# Altium project Arduino UNO R3-V2.PrjPcb
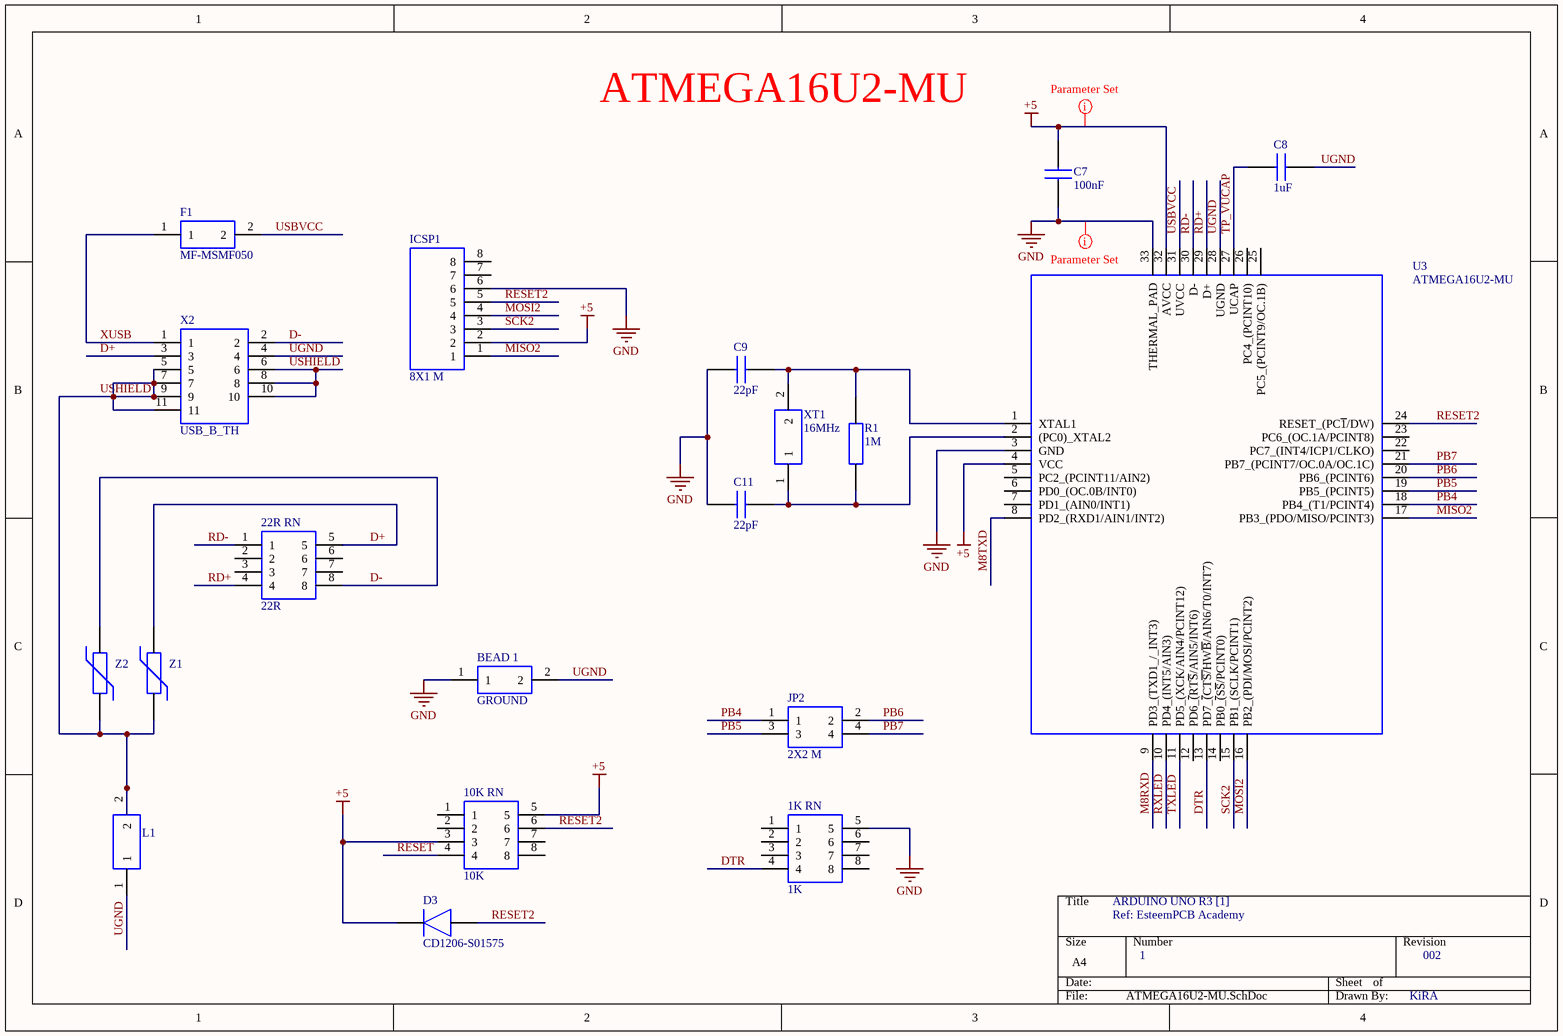
[diagram p0: ATMEGA16U2-MU.SchDoc]
3 sheets, 49 parts. Net scope: global (net labels, ports and power ports of the same name join across sheets).
Board file: Arduino.PcbDoc
Sheets:
  ATMEGA16U2-MU.SchDoc
  ATMega328P-PU.SchDoc
  Connectors & Regulators.SchDoc

## Sheet ATMEGA16U2-MU.SchDoc
size A4; SheetNumber: 1; SheetTotal: 3

### Parts
1K_RN  1K  [CAY10-XXXJ4]
10K_RN  10K  [CAY10-XXXJ4]
22R_RN  22R  [CAY10-XXXJ4]
BEAD_1  GROUND  [BEADC2012X105N]
C7  100nF  [CAPC2012X130N]
C8  1uF  [CAPC2012X145N]
C9  22pF  [CAPC2012X70N]
C11  22pF  [CAPC2012X70N]
D3  CD1206-S01575  [DIOC3016X65N]
F1  MF-MSMF050  [FUSC4632X75N]
ICSP1  8X1 M  [HDRV8W90P0X254_1X8_2032X249X560P]
JP2  2X2 M  [HDRV4W77P254_2X2_467X488X821P]
L1  BLM21BD601SH1D  [BEADC2012X105N]  (value not drawn)
R1  1M  [RESC1608X55N]
U3  ATMEGA16U2-MU  [QFN50P500X500X100-33N-D]
X2  USB_B_TH  [17340351]
XT1  16MHz  [MODEL-445]
Z1  CG0603MLC-05E  [VARC1608X55N]  (value not drawn)
Z2  CG0603MLC-05E  [VARC1608X55N]  (value not drawn)

### Nets
+5: 10K_RN.3 10K_RN.5 C7.2 D3.1(K) ICSP1.2 U3.4(VCC) U3.32(AVCC)
GND: 1K_RN.5 BEAD_1.1 C7.1 C9.1 C11.1 ICSP1.6 U3.3(GND) U3.33(THERMAL_PAD)
D+: 22R_RN.5 X2.3 Z1.2
D-: 22R_RN.8 X2.2 Z2.2
DTR: 1K_RN.4 U3.13(PD7_~{(}CT~{S/}HW~{B}/AIN6/T0/INT7))
M8RXD: U3.9(PD3_(TXD1_/_INT3))
M8TXD: U3.8(PD2_(RXD1/AIN1/INT2))
MISO2: ICSP1.1 U3.17(PB3_(PDO/MISO/PCINT3))
MOSI2: ICSP1.4 U3.16(PB2_(PDI/MOSI/PCINT2))
PB4: JP2.1 U3.18(PB4_(T1/PCINT4))
PB5: JP2.3 U3.19(PB5_(PCINT5))
PB6: JP2.2 U3.20(PB6_(PCINT6))
PB7: JP2.4 U3.21(PB7_(PCINT7/OC.0A/OC.1C))
RD+: 22R_RN.4 U3.29(D+)
RD-: 22R_RN.1 U3.30(D-)
RESET: 10K_RN.4
RESET2: 10K_RN.6 D3.2(A) ICSP1.5 U3.24(RESET_(PC~{1}/DW))
RXLED: U3.10(PD4_(INT5/AIN3))
SCK2: ICSP1.3 U3.15(PB1_(SCLK/PCINT1))
TP_VUCAP: C8.2 U3.27(UCAP)
TXLED: U3.11(PD5_(XCK/AIN4/PCINT12))
UGND: BEAD_1.2 C8.1 L1.1 U3.28(UGND) X2.4
USBVCC: F1.2 U3.31(UVCC)
USHIELD: L1.2 X2.5 X2.6 X2.7 X2.8 X2.9 X2.10 X2.11 Z1.1 Z2.1
XUSB: F1.1 X2.1
NetC9_2: C9.2 R1.2 U3.1(XTAL1) XT1.2
NetC11_2: C11.2 R1.1 U3.2((PC0)_XTAL2) XT1.1

Not connected (* = marked no-connect by the designer): 1K_RN 1 2 3 6 7 8; 10K_RN 1 2 7 8; 22R_RN 2 3 6 7; ICSP1 7 8; U3 5(PC2_(PCINT11/AIN2)) 6(PD0_(OC.0B/INT0)) 7(PD1_(AIN0/INT1)) 12(PD6_~{(}RT~{S}/AIN5/INT6)) 14(PB0_~{(}S~{S}/PCINT0)) 22(PC7_(INT4/ICP1/CLKO)) 23(PC6_(OC.1A/PCINT8)) 25(PC5_(PCINT9/OC.1B)) 26(PC4_(PCINT10))

### Layout directives
rule Width Constraint [Pref Width = 0.3mm    Min Width = 0.3mm    Max Width = 0.3mm]: +5, GND

### Notes on the sheet
- ATMEGA16U2-MU
- ARDUINO UNO R3 [1]
- Ref: EsteemPCB Academy
- 1
- 002
- KiRA

### Library data of the parts
1K_RN 10K_RN 22R_RN = CAY10-220J4LF: CAY10 convex chip resistor array,22R Bourns CAY10 Series 22 5% Isolated SMT Resistor Array, 4 Resistors, 0.125W total 0804 package Convex; Allied_Number: 70276318; Manufacturer_Name: Bourns; Manufacturer_Part_Number: CAY10-220J4LF; RS Part Number: 1674746; RS Price/Stock: http://uk.rs-online.com/web/p/products/1674746; Allied Price/Stock: https://www.alliedelec.com/bourns-cay10-220j4lf/70276318/; Mouser Part Number: 652-CAY10-220J4LF; Mouser Price/Stock: https://www.mouser.com/Search/Refine.aspx?Keyword=652-CAY10-220J4LF; Datasheet Link: http://docs-emea.rs-online.com/webdocs/064e/0900766b8064e463.pdf
BEAD_1 L1 = BLM21BD601SH1D: Chip Ferrite Bead 600R 0805 300mA 1LN; Manufacturer_Name: Murata Electronics; Geometry.Height: 1.05mm; Manufacturer_Part_Number: BLM21BD601SH1D; RS Part Number: 1048541P; RS Price/Stock: http://uk.rs-online.com/web/p/products/1048541P; Mouser Part Number: 81-BLM21BD601SH1D; Mouser Price/Stock: https://www.mouser.com/Search/Refine.aspx?Keyword=81-BLM21BD601SH1D; Datasheet Link: https://componentsearchengine.com/Datasheets/2/BLM21BD601SH1D.pdf
C7 = 0805Y0500104KXT: Syfer Technology 0805 Flexicap 100nF Ceramic Multilayer Capacitor, 50 V, +125C, X7R Dielectric, 10% SMD; Geometry.Height: 1.3mm; Manufacturer_Name: Syfer; Manufacturer_Part_Number: 0805Y0500104KXT; RS Part Number: 7738389P; RS Price/Stock: http://uk.rs-online.com/web/p/products/7738389P; Mouser Part Number: 7738389P; Mouser Price/Stock: http://uk.rs-online.com/web/p/products/7738389P; Datasheet Link: http://docs-emea.rs-online.com/webdocs/119d/0900766b8119d7bc.pdf
C8 = C2012C0G2A103J125AA: Multilayer Ceramic Capacitors MLCC - SMD/SMT 0805 C0G 100volts 0.01uF 5% 1.25mm; Manufacturer_Name: TDK; Geometry.Height: 1.45mm; Manufacturer_Part_Number: C2012C0G2A103J125AA; RS Part Number: *; RS Price/Stock: *; Mouser Part Number: 810-C2012C0G2A103JAA; Mouser Price/Stock: https://www.mouser.com/Search/Refine.aspx?Keyword=810-C2012C0G2A103JAA; Datasheet Link: https://product.tdk.com/info/en/catalog/datasheets/mlcc_commercial_midvoltage_en.pdf
C9 C11 = GRM2165C1H220JZ01D: MURATA - GRM2165C1H220JZ01D - CAP, MLCC, C0G/NP0, 22PF, 50V, 0805; Manufacturer_Name: Murata Electronics; Geometry.Height: 0.7mm; Manufacturer_Part_Number: GRM2165C1H220JZ01D; RS Part Number: 7236243; RS Price/Stock: http://uk.rs-online.com/web/p/products/7236243; Mouser Part Number: 81-GRM2165C1H220JZ; Mouser Price/Stock: https://www.mouser.com/Search/Refine.aspx?Keyword=81-GRM2165C1H220JZ; Datasheet Link: http://www.murata.com/~/media/webrenewal/support/library/catalog/products/capacitor/mlcc/c02e.pdf
D3 = CD1206-S01575: Diode Switching 100V 0.15A 4ns SMD1206 Bourns CD1206-S01575 Switching Diode, 150mA, 100V, 4ns, 2-Pin 1206; Allied_Number: 70154675; Geometry.Height: 0.65mm; Manufacturer_Name: Bourns; Manufacturer_Part_Number: CD1206-S01575; RS Part Number: 1775431; RS Price/Stock: http://uk.rs-online.com/web/p/products/1775431; Allied Price/Stock: http://www.alliedelec.com/bourns-cd1206-s01575/70154675/; Mouser Part Number: 652-CD1206-S01575; Mouser Price/Stock: https://www.mouser.com/Search/Refine.aspx?Keyword=652-CD1206-S01575; Datasheet Link: http://docs-emea.rs-online.com/webdocs/1189/0900766b811897a9.pdf
F1 = 1812L050_30PR: Littelfuse 0.5A Resettable Surface Mount Fuse, 30V dc; Manufacturer_Part_Number: 1812L050/30PR; Geometry.Height: 0.75mm; Manufacturer_Name: LITTELFUSE; RS Part Number: 8951631P; RS Price/Stock: http://uk.rs-online.com/web/p/products/8951631P; Mouser Part Number: 576-1812L050/30PR; Mouser Price/Stock: https://www.mouser.com/Search/Refine.aspx?Keyword=576-1812L050%2F30PR; Datasheet Link: https://www.arrow.com/en/products/1812l05030pr/littelfuse
ICSP1 = 90120-0768: 8 way single row straight header Molex C-GRID III Series, Series Number 90120, 2.54mm Pitch 8 Way 1 Row Straight Pin Header, Through Hole; Allied_Number: 70372836; Geometry.Height: 5.6mm; Manufacturer_Name: Molex; Manufacturer_Part_Number: 90120-0768; RS Part Number: 1671900; RS Price/Stock: http://uk.rs-online.com/web/p/products/1671900; Allied Price/Stock: https://www.alliedelec.com/molex-incorporated-90120-0768/70372836/; Mouser Part Number: 538-90120-0768; Mouser Price/Stock: https://www.mouser.com/Search/Refine.aspx?Keyword=538-90120-0768; Datasheet Link: http://www.molex.com/molex/products/datasheet.jsp?part=active/0901200768_PCB_HEADERS.xml
JP2 = 5-146256-2: AMP - TE CONNECTIVITY - 5-146256-2 - CONNECTOR, HEADER, 4 POSITION, 2ROWS, 2.54MM; Allied_Number: 70085239; Geometry.Height: 8.21mm; Manufacturer_Name: TE Connectivity; Manufacturer_Part_Number: 5-146256-2; RS Part Number: 7972955; RS Price/Stock: http://uk.rs-online.com/web/p/products/7972955; Allied Price/Stock: https://www.alliedelec.com/te-connectivity-5-146256-2/70085239/; Mouser Part Number: 571-5-146256-2; Mouser Price/Stock: https://www.mouser.com/Search/Refine.aspx?Keyword=571-5-146256-2; Datasheet Link: http://www.mouser.com/ds/2/418/NG_CD_146256_H-649289.pdf
R1 = CPF0603B1M0E1: TE CONNECTIVITY - CPF0603B1M0E1 - RES, THIN FILM, 1M, 0.1%, 0.063W, 0603; Geometry.Height: 0.55mm; Manufacturer_Name: TE Connectivity; Manufacturer_Part_Number: CPF0603B1M0E1; RS Part Number: *; RS Price/Stock: *; Mouser Part Number: 279-CPF0603B1M0E1; Mouser Price/Stock: https://www.mouser.com/Search/Refine.aspx?Keyword=279-CPF0603B1M0E1; Datasheet Link: http://www.farnell.com/datasheets/1786775.pdf
U3 = ATMEGA16U2-MU: 8-bit Microcontrollers - MCU AVR USB 8K FLASH AVR USB 16K FLASH; Manufacturer_Name: Microchip; Geometry.Height: 1mm; Manufacturer_Part_Number: ATMEGA16U2-MU; RS Part Number: 1717746; RS Price/Stock: http://uk.rs-online.com/web/p/products/1717746; Mouser Part Number: 556-ATMEGA16U2-MU; Mouser Price/Stock: https://www.mouser.com/Search/Refine.aspx?Keyword=556-ATMEGA16U2-MU; Datasheet Link: http://ww1.microchip.com/downloads/en/DeviceDoc/doc7799.pdf
X2 = 1734035-1: AMP - TE CONNECTIVITY - 1734035-1. - MINI USB, 2.0 TYPE B, RECEPTACLE, SMT; Allied_Number: 70086812; Geometry.Height: 4mm; Manufacturer_Name: TE Connectivity; Manufacturer_Part_Number: 1734035-1; RS Part Number: *; RS Price/Stock: *; Allied Price/Stock: https://www.alliedelec.com/te-connectivity-1734035-1/70086812/; Mouser Part Number: 571-1734035-1; Mouser Price/Stock: https://www.mouser.com/Search/Refine.aspx?Keyword=571-1734035-1; Datasheet Link: http://www.te.com/commerce/DocumentDelivery/DDEController?Action=srchrtrv&DocNm=1734035&DocType=Customer+Drawing&DocLang=English
XT1 = 445I35D16M00000: Crystals 16MHz +/-30ppm 18pF -40C +85C; Manufacturer_Name: CTS; Manufacturer_Part_Number: 445I35D16M00000; RS Part Number: *; RS Price/Stock: *; Mouser Part Number: 774-445I35D16M00000; Mouser Price/Stock: https://www.mouser.com/Search/Refine.aspx?Keyword=774-445I35D16M00000; Datasheet Link: http://www.mouser.com/ds/2/96/008-0360-0-786290.pdf
Z1 Z2 = CG0603MLC-05E: Varistor, ESD Protector, 5VDC,20V,0603 Bourns MLC Series Power Varistor 0.5pF 20V 0603 Case; Allied_Number: 70153503; Geometry.Height: 0.55mm; Manufacturer_Name: Bourns; Manufacturer_Part_Number: CG0603MLC-05E; RS Part Number: 8518256; RS Price/Stock: http://uk.rs-online.com/web/p/products/8518256; Allied Price/Stock: https://www.alliedelec.com/bourns-cg0603mlc-05e/70153503/; Mouser Part Number: 652-CG0603MLC-05E; Mouser Price/Stock: https://www.mouser.com/Search/Refine.aspx?Keyword=652-CG0603MLC-05E; Datasheet Link: http://www.farnell.com/datasheets/1785244.pdf

## Sheet ATMega328P-PU.SchDoc
size A4; SheetNumber: 2; SheetTotal: 3
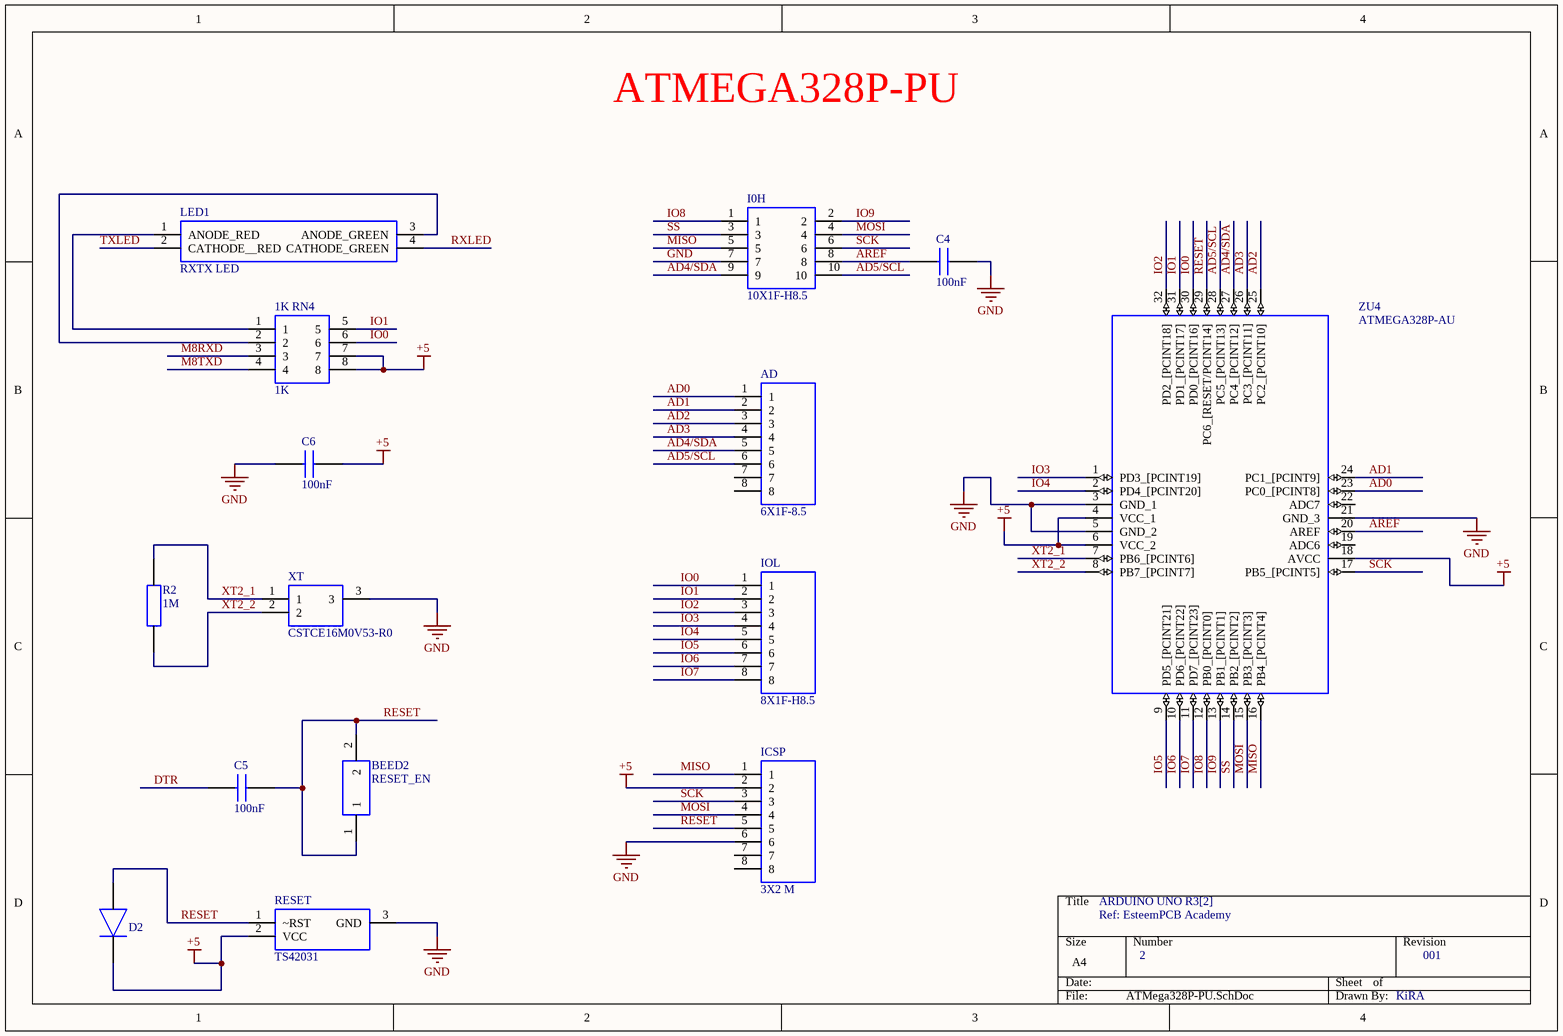
[diagram p1: ATMega328P-PU.SchDoc]

### Parts
1K_RN4  1K  [CAY10-XXXJ4]
AD  6X1F-8.5  [HDRV8W90P0X254_1X8_2032X249X560P]
BEED2  RESET_EN  [BEADC2012X105N]
C4  100nF  [CAPC2012X130N]
C5  100nF  [CAPC2012X130N]
C6  100nF  [CAPC2012X130N]
D2  CD1206-S01575  [DIOC3016X65N]  (value not drawn)
I0H  10X1F-H8.5  [FTMH10503LDV]
ICSP  3X2 M  [HDRV8W90P0X254_1X8_2032X249X560P]
IOL  8X1F-H8.5  [HDRV8W90P0X254_1X8_2032X249X560P]
LED1  RXTX LED  [SML522MD8WT86]
R2  1M  [RESC1608X55N]
RESET  TS42031  [SOT95P240X110-3N]
XT  CSTCE16M0V53-R0  [CSTCE-V]
ZU4  ATMEGA328P-AU  [QFP80P900X900X120-32N]

### Nets
+5: 1K_RN4.7 1K_RN4.8 C6.2 D2.1(K) ICSP.2 RESET.2(VCC) ZU4.4(VCC_1) ZU4.6(VCC_2) ZU4.18(AVCC)
GND: C4.2 C6.1 I0H.7 ICSP.6 RESET.3(GND) XT.3 ZU4.3(GND_1) ZU4.5(GND_2) ZU4.21(GND_3)
AD0: AD.1 ZU4.23(PC0_[PCINT8])
AD1: AD.2 ZU4.24(PC1_[PCINT9])
AD2: AD.3 ZU4.25(PC2_[PCINT10])
AD3: AD.4 ZU4.26(PC3_[PCINT11])
AD4/SDA: AD.5 I0H.9 ZU4.27(PC4_[PCINT12])
AD5/SCL: AD.6 I0H.10 ZU4.28(PC5_[PCINT13])
AREF: C4.1 I0H.8 ZU4.20(AREF)
DTR: C5.1
IO0: 1K_RN4.6 IOL.1 ZU4.30(PD0_[PCINT16])
IO1: 1K_RN4.5 IOL.2 ZU4.31(PD1_[PCINT17])
IO2: IOL.3 ZU4.32(PD2_[PCINT18])
IO3: IOL.4 ZU4.1(PD3_[PCINT19])
IO4: IOL.5 ZU4.2(PD4_[PCINT20])
IO5: IOL.6 ZU4.9(PD5_[PCINT21])
IO6: IOL.7 ZU4.10(PD6_[PCINT22])
IO7: IOL.8 ZU4.11(PD7_[PCINT23])
IO8: I0H.1 ZU4.12(PB0_[PCINT0])
IO9: I0H.2 ZU4.13(PB1_[PCINT1])
M8RXD: 1K_RN4.3
M8TXD: 1K_RN4.4
MISO: I0H.5 ICSP.1 ZU4.16(PB4_[PCINT4])
MOSI: I0H.4 ICSP.4 ZU4.15(PB3_[PCINT3])
RESET: BEED2.1 BEED2.2 C5.2 D2.2(A) ICSP.5 RESET.1(~RST) ZU4.29(PC6_[RESET/PCINT14])
RXLED: LED1.4(CATHODE_GREEN)
SCK: I0H.6 ICSP.3 ZU4.17(PB5_[PCINT5])
SS: I0H.3 ZU4.14(PB2_[PCINT2])
TXLED: LED1.2(CATHODE__RED)
XT2_1: R2.2 XT.1 ZU4.7(PB6_[PCINT6])
XT2_2: R2.1 XT.2 ZU4.8(PB7_[PCINT7])
Net1K_RN4_1: 1K_RN4.1 LED1.1(ANODE_RED)
Net1K_RN4_2: 1K_RN4.2 LED1.3(ANODE_GREEN)

Not connected (* = marked no-connect by the designer): AD 7 8; ICSP 7 8; ZU4 19(ADC6) 22(ADC7)

### Notes on the sheet
- ATMEGA328P-PU
- ARDUINO UNO R3[2]
- Ref: EsteemPCB Academy
- 2
- 001
- KiRA

### Library data of the parts
1K_RN4 = CAY10-220J4LF: as 1K_RN on sheet ATMEGA16U2-MU; Manufacturer_Name: Bourns; Manufacturer_Part_Number: CAY10-220J4LF; RS Part Number: 1674746; RS Price/Stock: http://uk.rs-online.com/web/p/products/1674746; Allied Price/Stock: https://www.alliedelec.com/bourns-cay10-220j4lf/70276318/; Mouser Part Number: 652-CAY10-220J4LF; Mouser Price/Stock: https://www.mouser.com/Search/Refine.aspx?Keyword=652-CAY10-220J4LF; Datasheet Link: http://docs-emea.rs-online.com/webdocs/064e/0900766b8064e463.pdf
AD ICSP IOL = 90120-0768: as ICSP1 on sheet ATMEGA16U2-MU; Manufacturer_Name: Molex; Manufacturer_Part_Number: 90120-0768; RS Part Number: 1671900; RS Price/Stock: http://uk.rs-online.com/web/p/products/1671900; Allied Price/Stock: https://www.alliedelec.com/molex-incorporated-90120-0768/70372836/; Mouser Part Number: 538-90120-0768; Mouser Price/Stock: https://www.mouser.com/Search/Refine.aspx?Keyword=538-90120-0768; Datasheet Link: http://www.molex.com/molex/products/datasheet.jsp?part=active/0901200768_PCB_HEADERS.xml
BEED2 = BLM21BD601SH1D: as BEAD_1 on sheet ATMEGA16U2-MU; Manufacturer_Part_Number: BLM21BD601SH1D; RS Part Number: 1048541P; RS Price/Stock: http://uk.rs-online.com/web/p/products/1048541P; Mouser Part Number: 81-BLM21BD601SH1D; Mouser Price/Stock: https://www.mouser.com/Search/Refine.aspx?Keyword=81-BLM21BD601SH1D; Datasheet Link: https://componentsearchengine.com/Datasheets/2/BLM21BD601SH1D.pdf
C4-C6 = 0805Y0500104KXT: as C7 on sheet ATMEGA16U2-MU; Manufacturer_Name: Syfer; Manufacturer_Part_Number: 0805Y0500104KXT; RS Part Number: 7738389P; RS Price/Stock: http://uk.rs-online.com/web/p/products/7738389P; Mouser Part Number: 7738389P; Mouser Price/Stock: http://uk.rs-online.com/web/p/products/7738389P; Datasheet Link: http://docs-emea.rs-online.com/webdocs/119d/0900766b8119d7bc.pdf
D2 = CD1206-S01575: as D3 on sheet ATMEGA16U2-MU; Manufacturer_Name: Bourns; Manufacturer_Part_Number: CD1206-S01575; RS Part Number: 1775431; RS Price/Stock: http://uk.rs-online.com/web/p/products/1775431; Allied Price/Stock: http://www.alliedelec.com/bourns-cd1206-s01575/70154675/; Mouser Part Number: 652-CD1206-S01575; Mouser Price/Stock: https://www.mouser.com/Search/Refine.aspx?Keyword=652-CD1206-S01575; Datasheet Link: http://docs-emea.rs-online.com/webdocs/1189/0900766b811897a9.pdf
I0H = FTMH-105-03-L-DV: Header 1mm PCB SMT vertical 10way Samtec FTMH Series, 1mm Pitch 10 Way 2 Row Straight Pin Header, Surface Mount, Solder Termination; Manufacturer_Name: SAMTEC; Manufacturer_Part_Number: FTMH-105-03-L-DV; RS Part Number: 7668984P; RS Price/Stock: http://uk.rs-online.com/web/p/products/7668984P; Mouser Part Number: 200-FTMH10503LDV; Mouser Price/Stock: https://www.mouser.com/Search/Refine.aspx?Keyword=200-FTMH10503LDV; Datasheet Link: http://suddendocs.samtec.com/prints/ftmh-1xx-xx-xx-dv-xx-mkt.pdf
LED1 = SML-522MU8WT86: Dual color mini-mold Chip LED: ROHM's chip LED lineup consists of standard type,top-view type, side-view type and reverse-mount type.; Manufacturer_Name: ROHM Semiconductor; Geometry.Height: 0mm; Manufacturer_Part_Number: SML-522MU8WT86; RS Part Number: 1682468; RS Price/Stock: http://uk.rs-online.com/web/p/products/1682468; Mouser Part Number: 755-SML-522MU8WT86; Mouser Price/Stock: https://www.mouser.com/Search/Refine.aspx?Keyword=755-SML-522MU8WT86; Datasheet Link: https://www.rohm.com/datasheet/SML-522MU8W/sml-52-e
R2 = CPF0603B1M0E1: as R1 on sheet ATMEGA16U2-MU; Manufacturer_Name: TE Connectivity; Manufacturer_Part_Number: CPF0603B1M0E1; RS Part Number: *; RS Price/Stock: *; Mouser Part Number: 279-CPF0603B1M0E1; Mouser Price/Stock: https://www.mouser.com/Search/Refine.aspx?Keyword=279-CPF0603B1M0E1; Datasheet Link: http://www.farnell.com/datasheets/1786775.pdf
RESET = DS1818R-5+: 3.3V EconoReset with Pushbutton; Manufacturer_Name: Maxim Integrated; Manufacturer_Part_Number: DS1818R-5+; RS Part Number: *; RS Price/Stock: *; Mouser Part Number: *; Mouser Price/Stock: *; Datasheet Link: *
XT = CSTCE16M0V53-R0: Ceramic resonator SMT CSTCE 16.00MHz CSTCE16M0V53-R0, Ceramic Resonator, 16MHz Expander 15pF, 3-Pin Cap Chip, 3.2 x 1.3 x 0.9mm; Manufacturer_Name: Murata Electronics; Manufacturer_Part_Number: CSTCE16M0V53-R0; RS Part Number: 7926524P; RS Price/Stock: http://uk.rs-online.com/web/p/products/7926524P; Mouser Part Number: 81-CSTCE16M0V53-R0; Mouser Price/Stock: https://www.mouser.com/Search/Refine.aspx?Keyword=81-CSTCE16M0V53-R0; Datasheet Link: http://uk.rs-online.com/web/p/products/6241077
ZU4 = ATMEGA328P-AU: MICROCHIP - ATMEGA328P-AU. - MICROCONTROLLER MCU, 8 BIT, ATMEGA, 20MHZ, TQFP-32; Geometry.Height: 1.2mm; Manufacturer_Name: Microchip; Manufacturer_Part_Number: ATMEGA328P-AU; RS Part Number: 1310271; RS Price/Stock: http://uk.rs-online.com/web/p/products/1310271; Mouser Part Number: 556-ATMEGA328P-AU; Mouser Price/Stock: https://www.mouser.com/Search/Refine.aspx?Keyword=556-ATMEGA328P-AU; Datasheet Link: https://componentsearchengine.com/Datasheets/2/ATMEGA328P-AU.pdf

## Sheet Connectors & Regulators.SchDoc
size A4; SheetNumber: 3; SheetTotal: 3
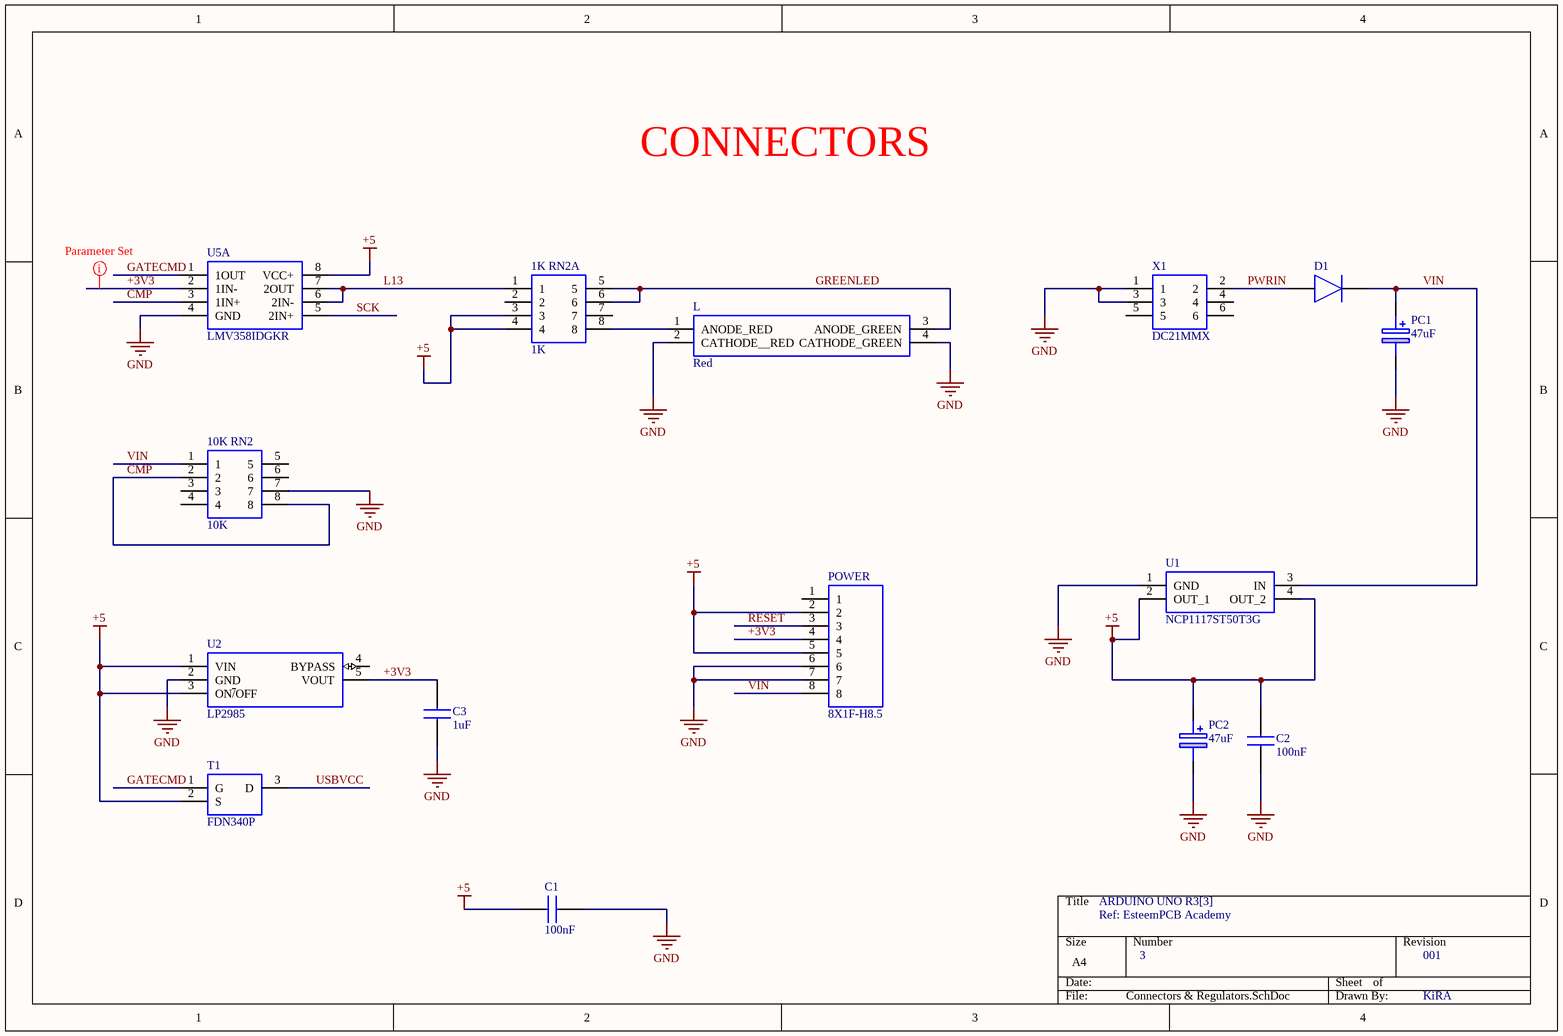
[diagram p2: Connectors & Regulators.SchDoc]

### Parts
1K_RN2A  1K  [CAY10-XXXJ4]
10K_RN2  10K  [CAY10-XXXJ4]
C1  100nF  [CAPC2012X130N]
C2  100nF  [CAPC2012X130N]
C3  1uF  [CAPC2012X145N]
D1  CD1206-S01575  [DIOC3016X65N]  (value not drawn)
L  Red  [SML522MD8WT86]
PC1  47uF  [CAPAE530X610N]
PC2  47uF  [CAPAE530X610N]
POWER  8X1F-H8.5  [HDRV8W90P0X254_1X8_2032X249X560P]
T1  FDN340P  [SOT95P251X112-3N]
U1  NCP1117ST50T3G  [SOT230P700X180-4N]
U2  LP2985  [SOT95P280X145-5N]
U5A  LMV358IDGKR  [SOP65P490X110-8N]
X1  DC21MMX  [USBBSRA]

### Nets
+5: 1K_RN2A.3 1K_RN2A.4 C1.1 C2.1 PC2.1(+) POWER.2 POWER.5 T1.2(S) U1.2(OUT_1) U1.4(OUT_2) U2.1(VIN) U2.3(ON~{/}OFF) U5A.8(VCC+)
GND: 10K_RN2.7 C1.2 C2.2 C3.2 L.2(CATHODE__RED) L.4(CATHODE_GREEN) PC1.2(-) PC2.2(-) POWER.6 POWER.7 U1.1(GND) U2.2(GND) U5A.4(GND) X1.1 X1.3
+3V3: C3.1 POWER.4 U2.5(VOUT) U5A.2(1IN-)
CMP: 10K_RN2.2 10K_RN2.8 U5A.3(1IN+)
GATECMD: T1.1(G) U5A.1(1OUT)
GREENLED: 1K_RN2A.5 1K_RN2A.6 L.3(ANODE_GREEN)
L13: 1K_RN2A.1 U5A.6(2IN-) U5A.7(2OUT)
PWRIN: D1.2(A) X1.2
RESET: POWER.3
SCK: U5A.5(2IN+)
USBVCC: T1.3(D)
VIN: 10K_RN2.1 D1.1(K) PC1.1(+) POWER.8 U1.3(IN)
Net1K_RN2A_8: 1K_RN2A.8 L.1(ANODE_RED)

Not connected (* = marked no-connect by the designer): 1K_RN2A 2 7; 10K_RN2 3 4 5 6; POWER 1; U2 4(BYPASS); X1 4 5 6

### Layout directives
rule Width Constraint [Pref Width = 0.3mm    Min Width = 0.3mm    Max Width = 0.3mm]: +3V3

### Notes on the sheet
- CONNECTORS
- ARDUINO UNO R3[3]
- Ref: EsteemPCB Academy
- 3
- 001
- KiRA

### Library data of the parts
1K_RN2A 10K_RN2 = CAY10-220J4LF: as 1K_RN on sheet ATMEGA16U2-MU; Manufacturer_Name: Bourns; Manufacturer_Part_Number: CAY10-220J4LF; RS Part Number: 1674746; RS Price/Stock: http://uk.rs-online.com/web/p/products/1674746; Allied Price/Stock: https://www.alliedelec.com/bourns-cay10-220j4lf/70276318/; Mouser Part Number: 652-CAY10-220J4LF; Mouser Price/Stock: https://www.mouser.com/Search/Refine.aspx?Keyword=652-CAY10-220J4LF; Datasheet Link: http://docs-emea.rs-online.com/webdocs/064e/0900766b8064e463.pdf
C1 C2 = 0805Y0500104KXT: as C7 on sheet ATMEGA16U2-MU; Manufacturer_Name: Syfer; Manufacturer_Part_Number: 0805Y0500104KXT; RS Part Number: 7738389P; RS Price/Stock: http://uk.rs-online.com/web/p/products/7738389P; Mouser Part Number: 7738389P; Mouser Price/Stock: http://uk.rs-online.com/web/p/products/7738389P; Datasheet Link: http://docs-emea.rs-online.com/webdocs/119d/0900766b8119d7bc.pdf
C3 = C2012C0G2A103J125AA: as C8 on sheet ATMEGA16U2-MU; Manufacturer_Part_Number: C2012C0G2A103J125AA; RS Part Number: *; RS Price/Stock: *; Mouser Part Number: 810-C2012C0G2A103JAA; Mouser Price/Stock: https://www.mouser.com/Search/Refine.aspx?Keyword=810-C2012C0G2A103JAA; Datasheet Link: https://product.tdk.com/info/en/catalog/datasheets/mlcc_commercial_midvoltage_en.pdf
D1 = CD1206-S01575: as D3 on sheet ATMEGA16U2-MU; Manufacturer_Name: Bourns; Manufacturer_Part_Number: CD1206-S01575; RS Part Number: 1775431; RS Price/Stock: http://uk.rs-online.com/web/p/products/1775431; Allied Price/Stock: http://www.alliedelec.com/bourns-cd1206-s01575/70154675/; Mouser Part Number: 652-CD1206-S01575; Mouser Price/Stock: https://www.mouser.com/Search/Refine.aspx?Keyword=652-CD1206-S01575; Datasheet Link: http://docs-emea.rs-online.com/webdocs/1189/0900766b811897a9.pdf
L = SML-522MU8WT86: as LED1 on sheet ATMega328P-PU; Manufacturer_Part_Number: SML-522MU8WT86; RS Part Number: 1682468; RS Price/Stock: http://uk.rs-online.com/web/p/products/1682468; Mouser Part Number: 755-SML-522MU8WT86; Mouser Price/Stock: https://www.mouser.com/Search/Refine.aspx?Keyword=755-SML-522MU8WT86; Datasheet Link: https://www.rohm.com/datasheet/SML-522MU8W/sml-52-e
PC1 PC2 = EEE-FT1V470AR: Aluminum Electrolytic Capacitors - SMD 47uF 35volts 5x5.8mm SMD; Manufacturer_Name: Panasonic; Allied_Number: 70258388; Geometry.Height: 6.1mm; Manufacturer_Part_Number: EEE-FT1V470AR; RS Part Number: *; RS Price/Stock: *; Allied Price/Stock: https://www.alliedelec.com/panasonic-eee-ft1v470ar/70258388/; Mouser Part Number: 667-EEE-FT1V470AR; Mouser Price/Stock: https://www.mouser.com/Search/Refine.aspx?Keyword=667-EEE-FT1V470AR; Datasheet Link: https://industrial.panasonic.com/cdbs/www-data/pdf/RDE0000/ABA0000C1240.pdf
POWER = 90120-0768: as ICSP1 on sheet ATMEGA16U2-MU; Manufacturer_Name: Molex; Manufacturer_Part_Number: 90120-0768; RS Part Number: 1671900; RS Price/Stock: http://uk.rs-online.com/web/p/products/1671900; Allied Price/Stock: https://www.alliedelec.com/molex-incorporated-90120-0768/70372836/; Mouser Part Number: 538-90120-0768; Mouser Price/Stock: https://www.mouser.com/Search/Refine.aspx?Keyword=538-90120-0768; Datasheet Link: http://www.molex.com/molex/products/datasheet.jsp?part=active/0901200768_PCB_HEADERS.xml
T1 = FDN340P: FDN340P, P-channel MOSFET Transistor 2 A 20 V, 3-Pin SuperSOT; Manufacturer_Name: Fairchild Semiconductor; Geometry.Height: 1.12mm; Manufacturer_Part_Number: FDN340P; RS Part Number: 6710435P; RS Price/Stock: http://uk.rs-online.com/web/p/products/6710435P; Mouser Part Number: 512-FDN340P; Mouser Price/Stock: https://www.mouser.com/Search/Refine.aspx?Keyword=512-FDN340P; Datasheet Link: http://docs-emea.rs-online.com/webdocs/0d23/0900766b80d23111.pdf
U1 = NCP1117ST50T3G: ON SEMICONDUCTOR - NCP1117ST50T3G - LDO, REG, 20VIN, 1A, 5V, 1%, SOT223-3; Allied_Number: 70466898; Geometry.Height: 1.8mm; Manufacturer_Name: ON Semiconductor; Manufacturer_Part_Number: NCP1117ST50T3G; RS Part Number: 8022130P; RS Price/Stock: http://uk.rs-online.com/web/p/products/8022130P; Allied Price/Stock: http://www.alliedelec.com/on-semiconductor-ncp1117st50t3g/70466898/; Mouser Part Number: 863-NCP1117ST50T3G; Mouser Price/Stock: https://www.mouser.com/Search/Refine.aspx?Keyword=863-NCP1117ST50T3G; Datasheet Link: http://www.onsemi.com/pub/Collateral/NCP1117-D.PDF
U2 = LP2985-33DBVR: 150-mA Low-noise Low-dropout Regulator With Shutdown; Manufacturer_Name: Texas Instruments; Geometry.Height: 1.45mm; Manufacturer_Part_Number: LP2985-33DBVR; RS Part Number: *; RS Price/Stock: *; Mouser Part Number: 595-LP2985-33DBVR; Mouser Price/Stock: https://www.mouser.com/Search/Refine.aspx?Keyword=595-LP2985-33DBVR; Datasheet Link: http://www.ti.com/lit/gpn/lp2985
U5A = LMV358IDGKR: OP Amp Dual GP R-R O/P 5.5V 8-Pin MSOP Texas Instruments LMV358IDGKR, Dual Op Amp, 1MHz CMOS, Rail to Rail, 3 V, 5 V, 8-Pin MSOP; Geometry.Height: 1.1mm; Manufacturer_Name: Texas Instruments; Manufacturer_Part_Number: LMV358IDGKR; RS Part Number: 1625114; RS Price/Stock: http://uk.rs-online.com/web/p/products/1625114; Mouser Part Number: 595-LMV358IDGKR; Mouser Price/Stock: https://www.mouser.com/Search/Refine.aspx?Keyword=595-LMV358IDGKR; Datasheet Link: http://www.ti.com/lit/ds/symlink/lmv358.pdf
X1 = USB-B-S-RA: MULTICOMP - USB-B-S-RA - USB, 2.0 TYPE B, RECEPTACLE, TH; Geometry.Height: 10mm; Manufacturer_Name: MULTICOMP; Manufacturer_Part_Number: USB-B-S-RA; RS Part Number: *; RS Price/Stock: *; Mouser Part Number: *; Mouser Price/Stock: *; Datasheet Link: http://www.farnell.com/datasheets/1788391.pdf

## Nets that join several sheets
+5: ATMEGA16U2-MU (7 pins), ATMega328P-PU (9 pins), Connectors & Regulators (13 pins)
GND: ATMEGA16U2-MU (8 pins), ATMega328P-PU (9 pins), Connectors & Regulators (15 pins)
DTR: ATMEGA16U2-MU (1K_RN.4 U3.13), ATMega328P-PU (C5.1)
M8RXD: ATMEGA16U2-MU (U3.9), ATMega328P-PU (1K_RN4.3)
M8TXD: ATMEGA16U2-MU (U3.8), ATMega328P-PU (1K_RN4.4)
RESET: ATMEGA16U2-MU (10K_RN.4), ATMega328P-PU (7 pins), Connectors & Regulators (POWER.3)
RXLED: ATMEGA16U2-MU (U3.10), ATMega328P-PU (LED1.4)
SCK: ATMega328P-PU (I0H.6 ICSP.3 ZU4.17), Connectors & Regulators (U5A.5)
TXLED: ATMEGA16U2-MU (U3.11), ATMega328P-PU (LED1.2)
USBVCC: ATMEGA16U2-MU (F1.2 U3.31), Connectors & Regulators (T1.3)